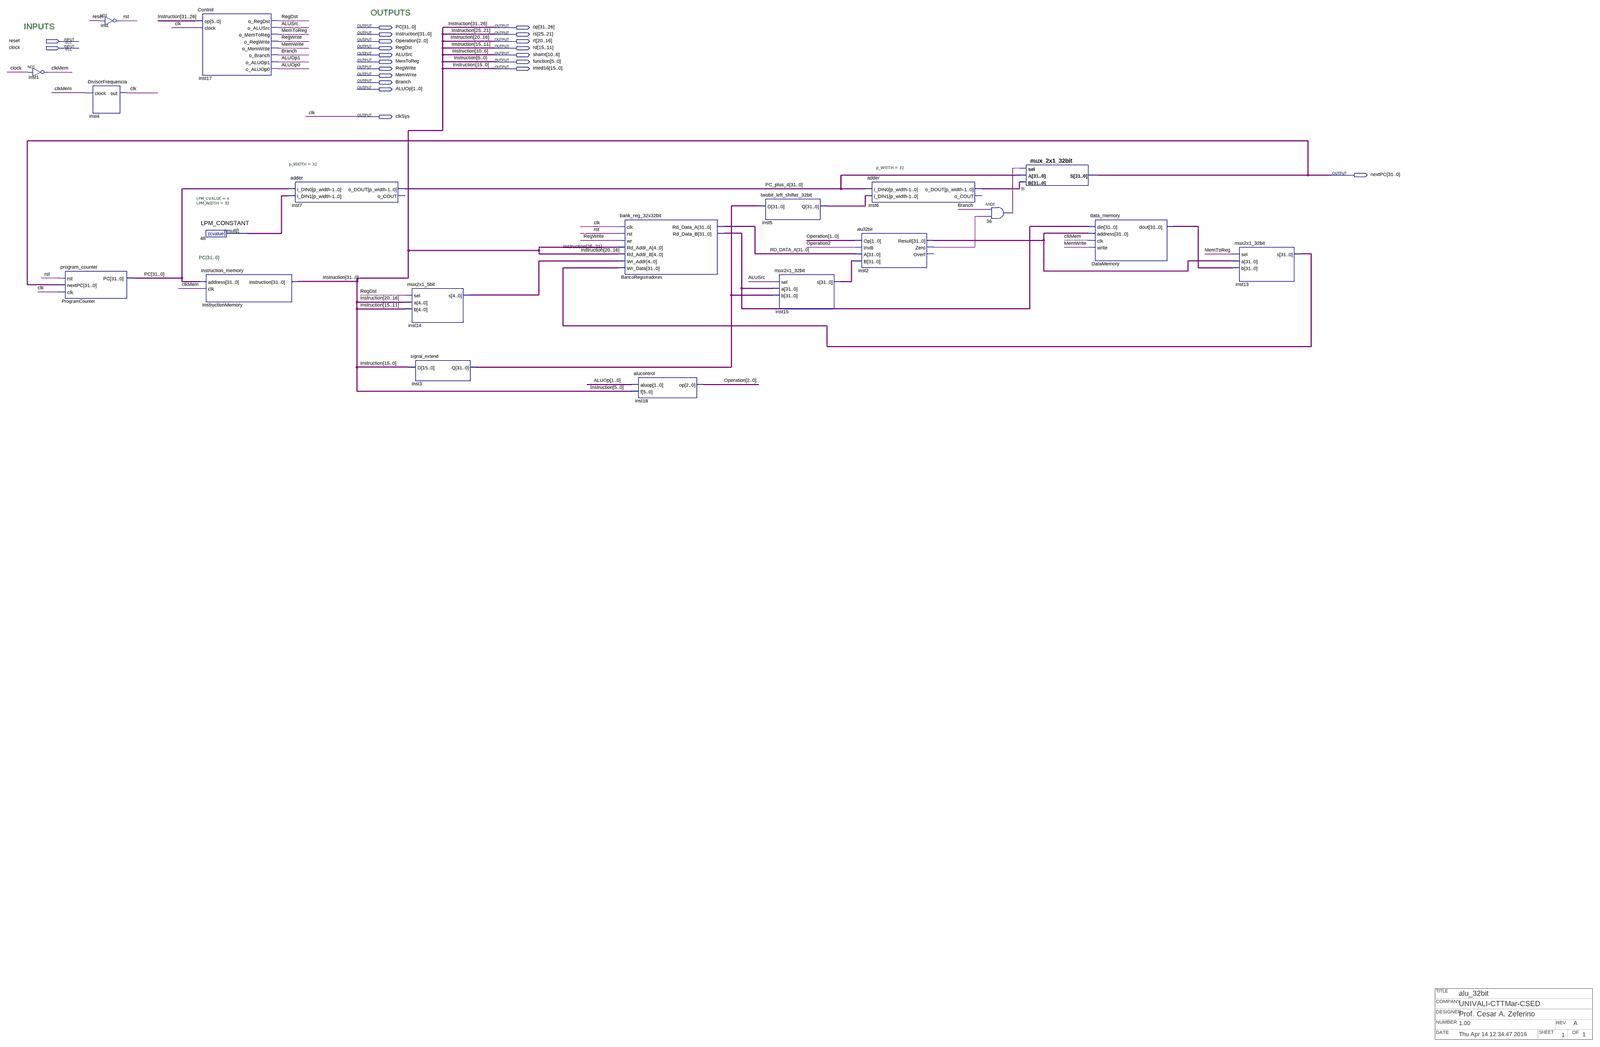
[diagram p0: schematic sheet, whole]
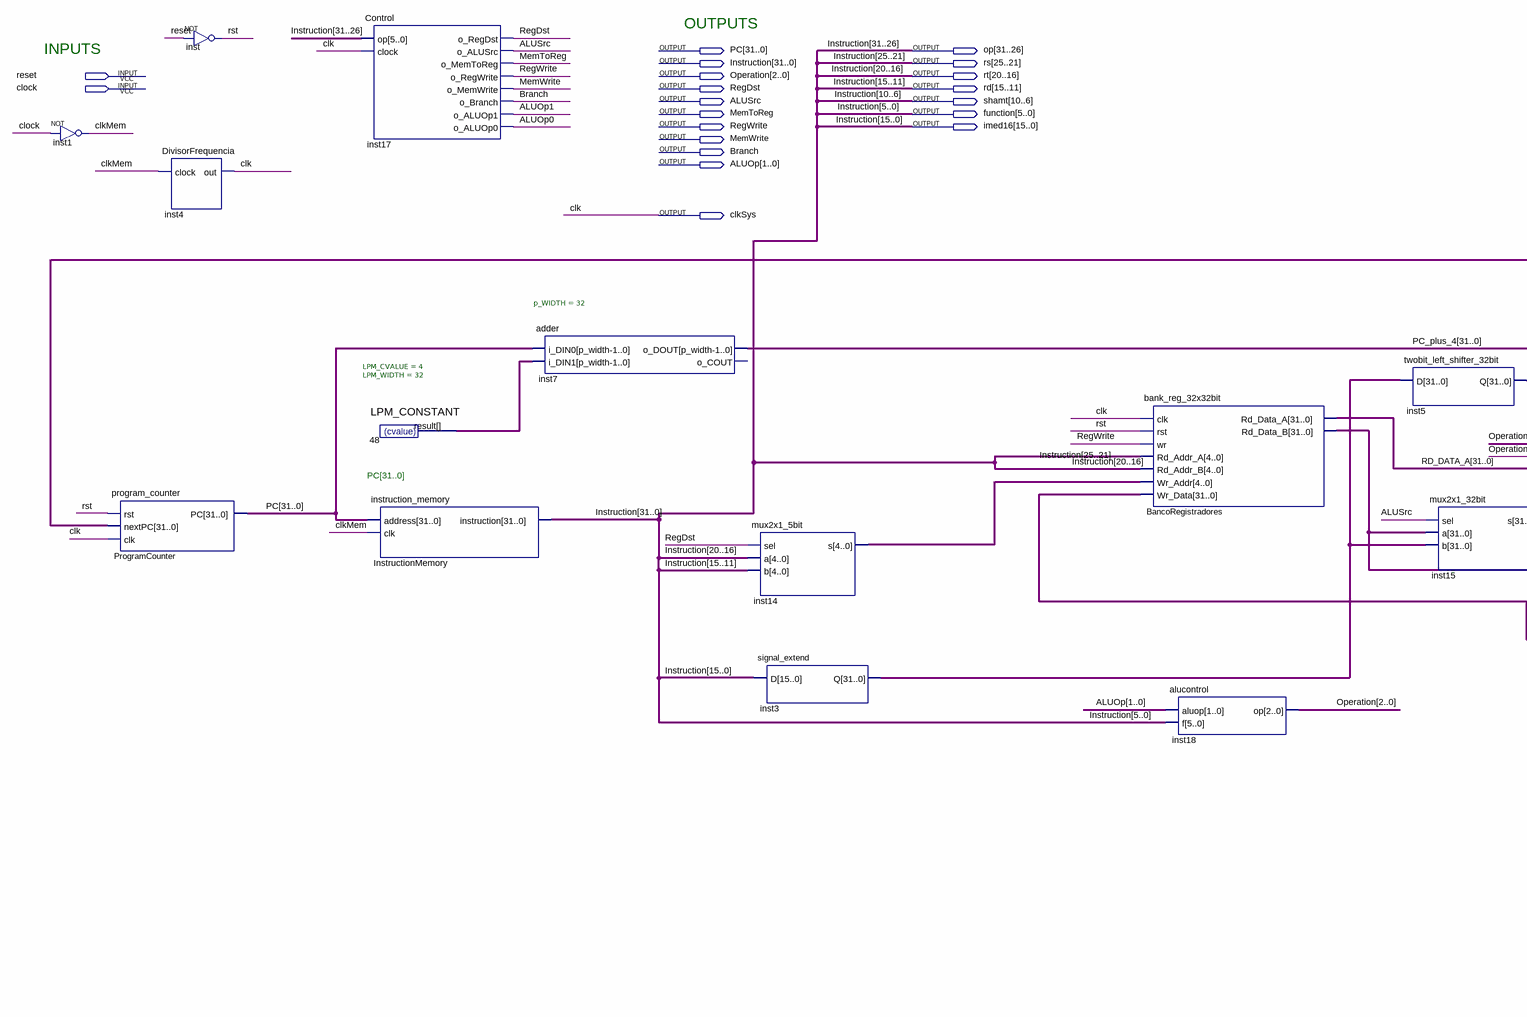
[diagram p1: schematic sheet, upper left part]
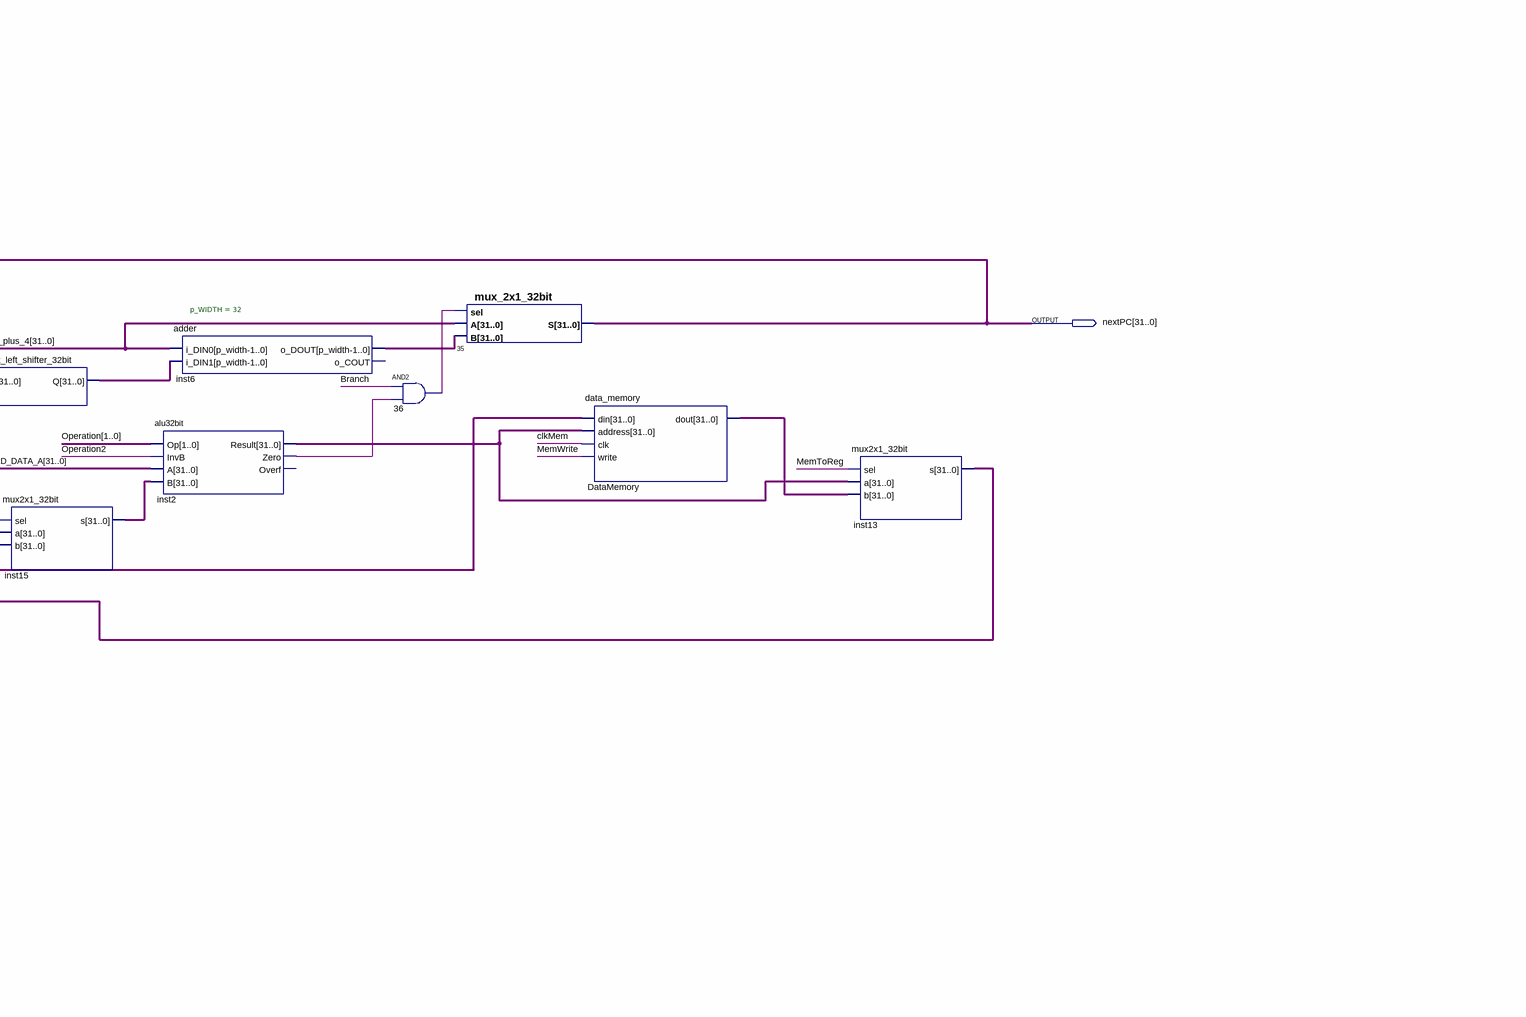
[diagram p2: schematic sheet, upper right part]
// Quartus schematic mips_mono.bdf as structural Verilog: 20 symbols, 21 pins
// Title block: TITLE: alu_32bit; COMPANY: UNIVALI-CTTMar-CSED; DESIGNER: Prof. Cesar A. Zeferino; NUMBER: 1.00; REV: A; DATE: Thu Apr 14 12:34:47 2016; SHEET: 1; OF: 1
module mips_mono (
  input  reset,
  input  clock,
  output [31:0] PC,
  output [31:26] op,
  output [31:0] Instruction,
  output [25:21] rs,
  output [2:0] Operation,
  output [20:16] rt,
  output RegDst,
  output [15:11] rd,
  output ALUSrc,
  output [10:6] shamt,
  output MemToReg,
  output [5:0] \function ,
  output RegWrite,
  output [15:0] imed16,
  output MemWrite,
  output Branch,
  output [1:0] ALUOp,
  output clkSys,
  output [31:0] nextPC
);

  wire clkMem, inst2_zero, n36_out, rst;
  wire [4:0] inst14_s;
  wire [31:0] BancoRegistradores_rd_data_b, DataMemory_dout, inst2_result, inst3_q, inst5_q, inst6_o_dout,
       inst13_s, inst15_s, n48_result, PC_plus_4, RD_DATA_A;

  not inst1 (clkMem, clock);
  program_counter ProgramCounter (.rst(rst), .nextPC(nextPC), .clk(clkSys), .PC(PC));
  not inst (rst, reset);
  DivisorFrequencia inst4 (.clock(clkMem), .out(clkSys));
  Control inst17 (
    .op(Instruction[31:26]), .clock(clkSys), .o_RegDst(RegDst), .o_ALUSrc(ALUSrc), .o_MemToReg(MemToReg),
    .o_RegWrite(RegWrite), .o_MemWrite(MemWrite), .o_Branch(Branch), .o_ALUOp1(ALUOp[1]), .o_ALUOp0(ALUOp[0]));
  LPM_CONSTANT #(.LPM_CVALUE(4), .LPM_WIDTH(32)) u_48 (.result(n48_result));
  instruction_memory InstructionMemory (
    .address(PC), .clk(clkMem), .instruction({Instruction[31:16], imed16[15:6], \function }));
  adder #(.p_WIDTH(32)) inst7 (.i_DIN0(PC), .i_DIN1(n48_result), .o_DOUT(PC_plus_4));  // open: o_COUT
  mux2x1_5bit inst14 (.sel(RegDst), .a(Instruction[20:16]), .b(imed16[15:11]), .s(inst14_s));
  signal_extend inst3 (.D({imed16[15:6], \function }), .Q(inst3_q));
  bank_reg_32x32bit BancoRegistradores (
    .clk(clkSys), .rst(rst), .wr(RegWrite), .Rd_Addr_A(Instruction[25:21]), .Rd_Addr_B(Instruction[20:16]),
    .Wr_Addr(inst14_s), .Wr_Data(inst13_s), .Rd_Data_A(RD_DATA_A), .Rd_Data_B(BancoRegistradores_rd_data_b));
  alucontrol inst18 (.aluop(ALUOp), .f(\function ), .op(Operation));
  twobit_left_shifter_32bit inst5 (.D(inst3_q), .Q(inst5_q));
  mux2x1_32bit inst15 (.sel(ALUSrc), .a(BancoRegistradores_rd_data_b), .b(inst3_q), .s(inst15_s));
  adder #(.p_WIDTH(32)) inst6 (.i_DIN0(PC_plus_4), .i_DIN1(inst5_q), .o_DOUT(inst6_o_dout));  // open: o_COUT
  alu32bit inst2 (
    .Op(Operation[1:0]), .InvB(Operation[2]), .A(RD_DATA_A), .B(inst15_s), .Result(inst2_result),
    .Zero(inst2_zero));  // open: Overf
  and u_36 (n36_out, Branch, inst2_zero);
  mux_2x1_32bit u_35 (.sel(n36_out), .A(PC_plus_4), .B(inst6_o_dout), .S(nextPC));
  data_memory DataMemory (
    .din(BancoRegistradores_rd_data_b), .address(inst2_result), .clk(clkMem), .write(MemWrite),
    .dout(DataMemory_dout));
  mux2x1_32bit inst13 (.sel(MemToReg), .a(inst2_result), .b(DataMemory_dout), .s(inst13_s));

  assign imed16[5:0] = \function ;
  assign Instruction[15:0] = {imed16[15:6], \function };
  assign op = Instruction[31:26];
  assign rd = imed16[15:11];
  assign rs = Instruction[25:21];
  assign rt = Instruction[20:16];
  assign shamt = imed16[10:6];

  // Other names for the same wires on the sheet: clk = clkSys

  // Notes on the sheet:
  //   OUTPUTS
  //   INPUTS
  //   PC[31..0]
endmodule
